# EasyEDA Pro project ProPrj_嵌赛国赛_2025-08-15.epro, board PCB4
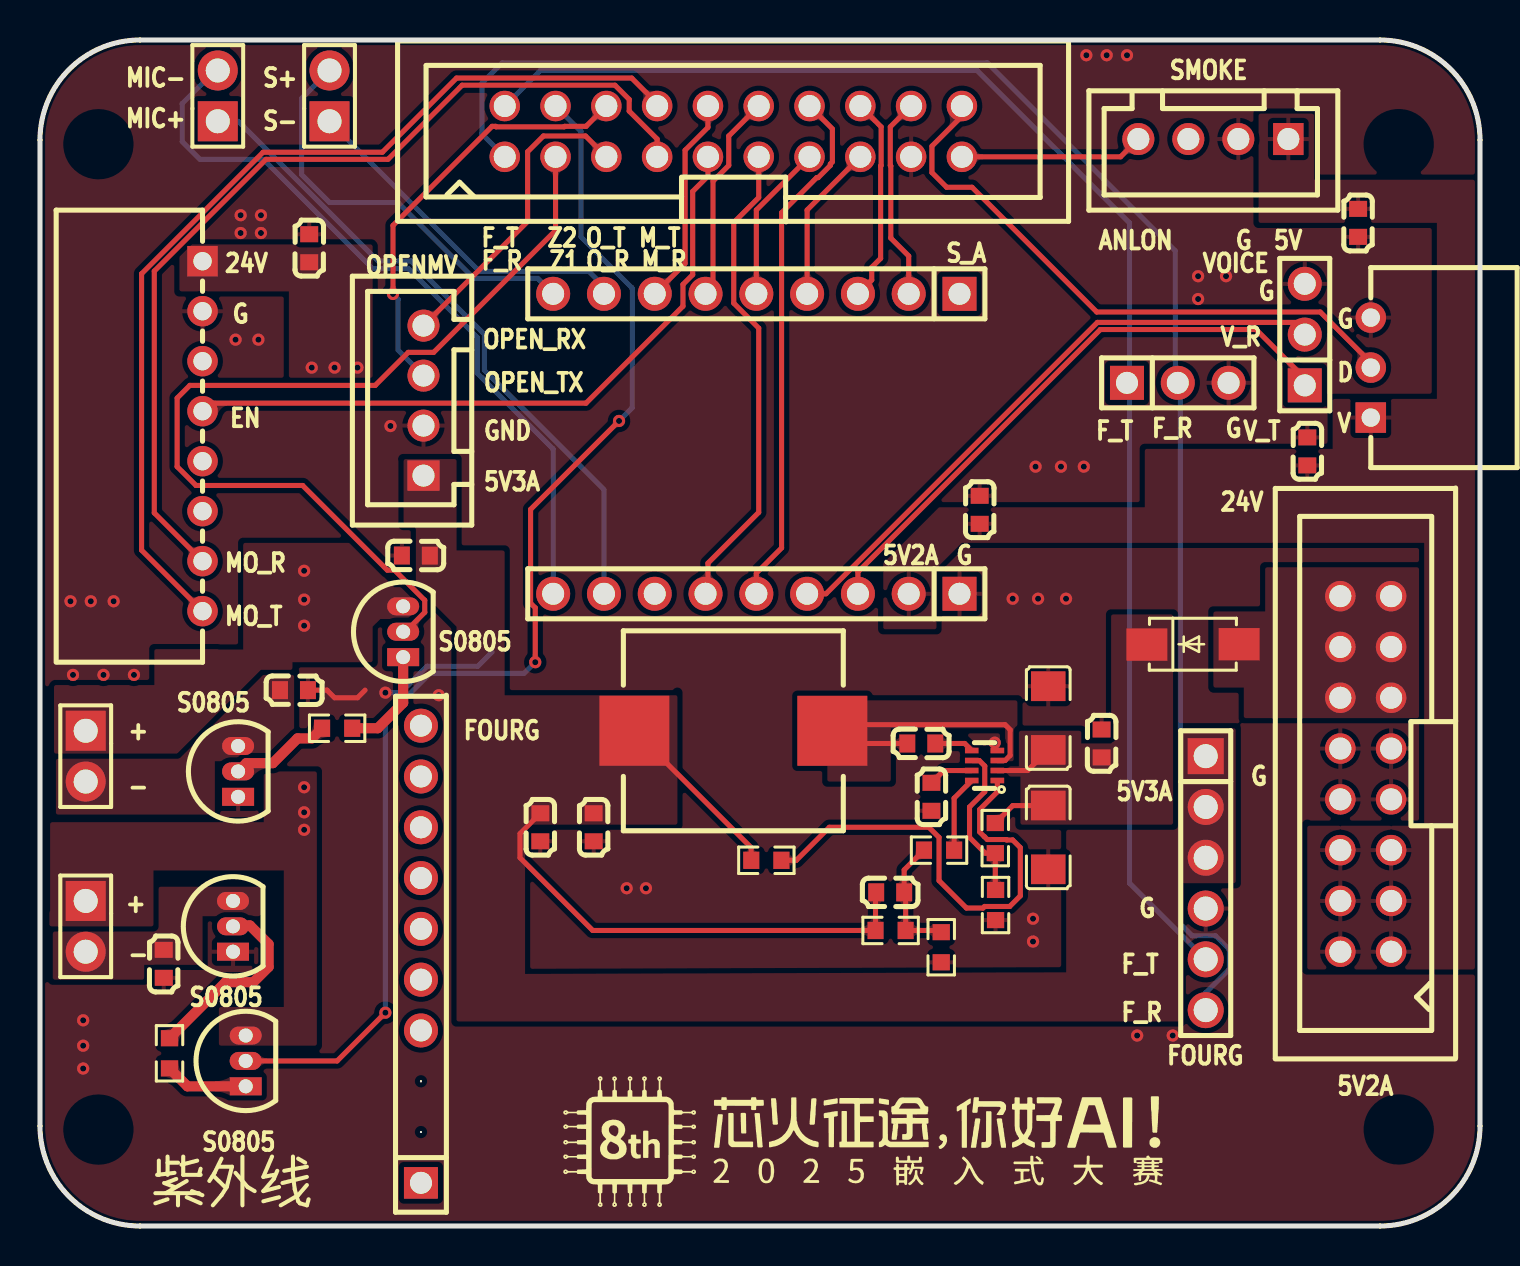
[diagram p18: board, top side]
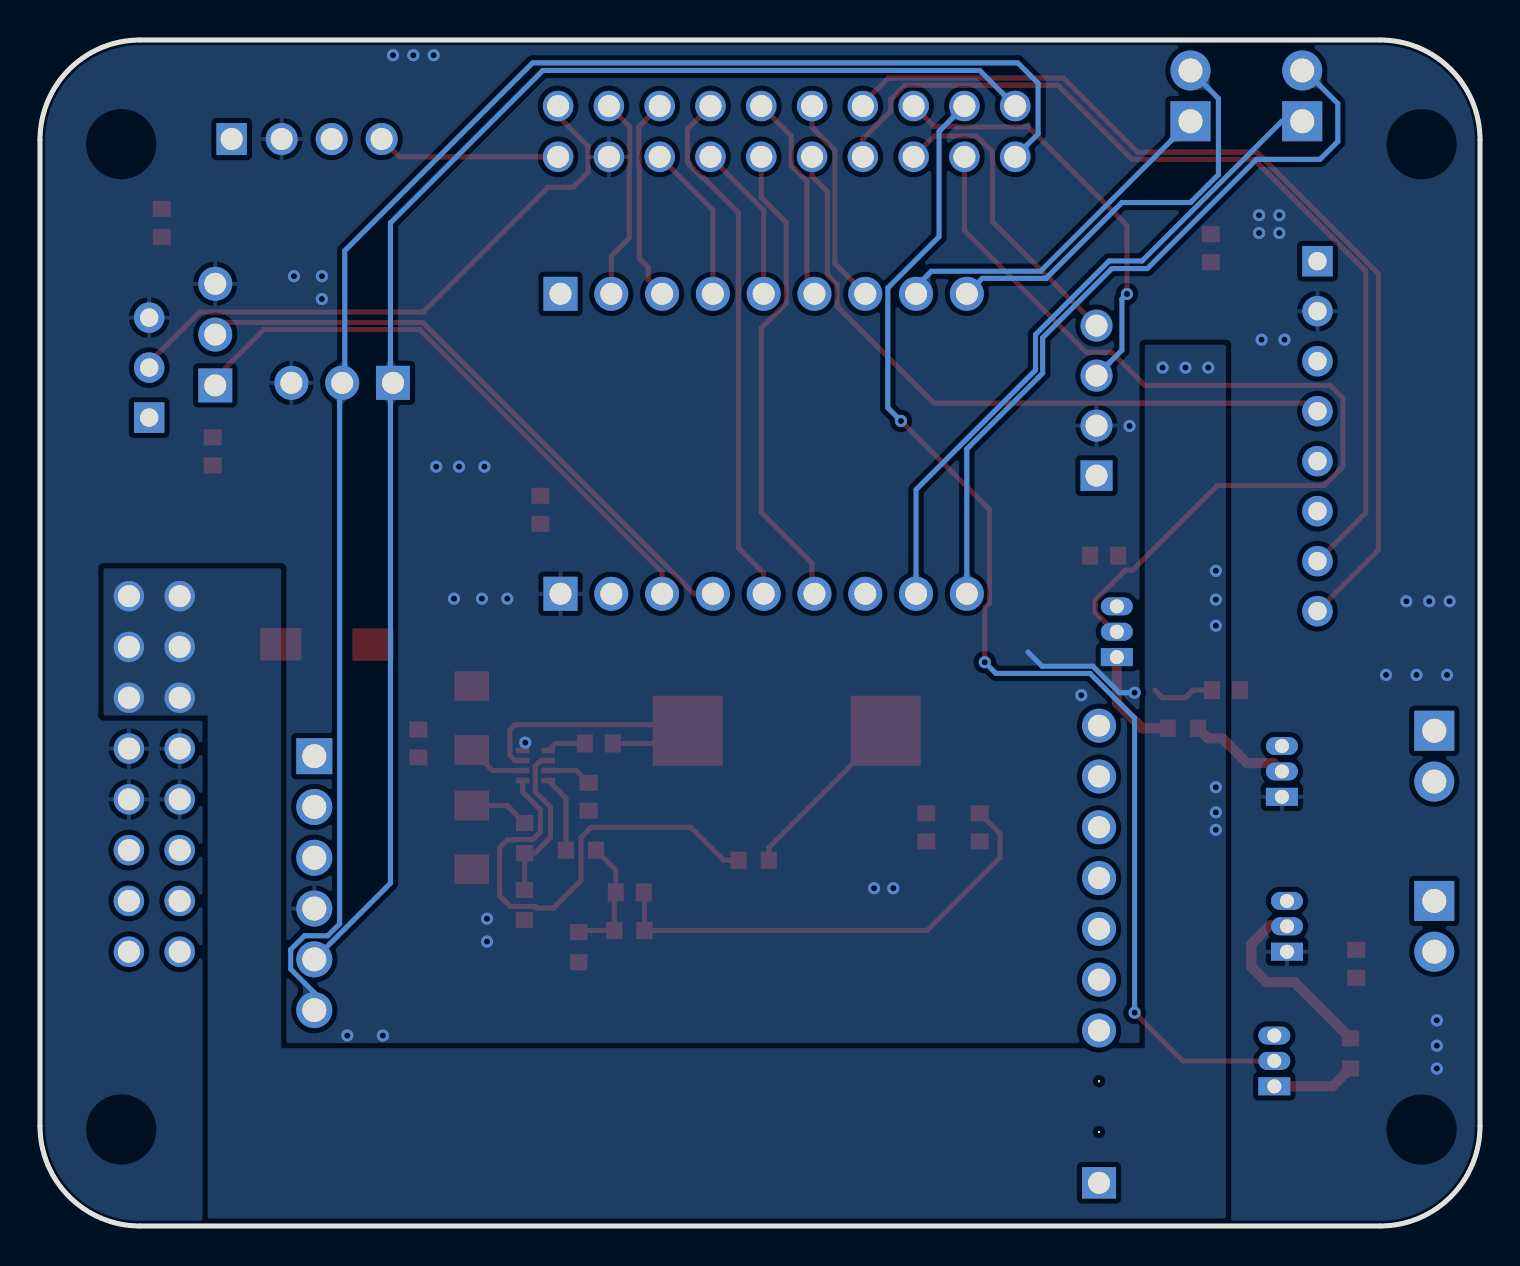
[diagram p19: board, bottom side, seen from below]

Outline 72.01 x 59.31 mm; copper layers: Top Layer, Bottom Layer. Coordinates in mm from the lower left corner of the outline.
Outline path: 0,54.31 0,5 arc(1.46,1.46) 5,0 67.01,0 arc(70.54,1.46) 72.01,5 72.01,54.31 arc(70.54,57.84) 67.01,59.31 5,59.31 arc(1.46,57.84) 0,54.31
Stack: Top Layer 0.035mm / Dielectric1 1.51mm FR4 er 4.5 / Bottom Layer 0.035mm

## Design rules (mm)
template: 自定义配置
spacing copperThickness1oz (default): track to track 0.102, other pairs 0.152 to 0.3
spacing copperThickness2oz: track to track 0.203, other pairs 0.152 to 0.3
track width copperThickness1oz (default): min 0.127, default 0.254, max 2.54
track width copperThickness2oz: min 0.203, default 0.254, max 2.54
differential pair differentialPair (default): width min 0.127, default 0.254, max 2.54; gap min 0.152, default 0.152
via viaSize (default): diameter min 0.5, default 0.61, max 10; hole min 0.3, default 0.305, max 6.3
net 24V_OUT uses 21
net 24_VIN uses 21
net $2N854 uses 21
net VIN uses 21
net $1N464 uses 21
net $1N705 uses 21

## Placement (name value [footprint] x y rotation side)
C77  100nF  [C0603]  53.09 24.13 270 top
C78  10uF  [C1206]  50.42 25.4 270 top
C79  10uF  [C1206]  50.42 19.43 90 top
C80  22nF  [C0603]  44.58 21.46 270 top
C81  100nF  [C0603]  44.07 24.13 0 top
C82  22uF  [C0603]  27.69 19.94 270 top
C83  22uF  [C0603]  25.02 19.94 270 top
C84  300pF  [C0603]  42.51 16.68 180 top
C85  100nF  [C0603]  12.7 26.8 180 top
C86  100nF  [C0603]  6.19 13.11 90 top
C87  100nF  [C0603]  46.99 35.81 270 top
C88  100nF  [C0603]  65.91 50.16 90 top
C90  100nF  [C0603]  13.46 48.89 270 top
C91  100nF  [C0603]  18.8 33.53 0 top
C92  100nF  [C0603]  63.37 38.73 270 top
CN1  ZX-XH2.54-4PZZ  [CONN-TH_4P-P2.50_4PIN]  58.67 54.36 180 top
CN3  BH254V-20P  [CONN-TH_20P-P2.54_0702462001]  34.67 54.74 0 top
CN4  ZX-XH2.54-4PZZ  [CONN-TH_4P-P2.50_4PIN]  19.18 41.27 90 top
D1  SS34  [SMA_L4.3-W2.6-LS5.0-FD]  57.66 29.08 180 top
H1  PZ254V-11-02P  [HDR-TH_2P-P2.54-V-M]  2.29 23.49 270 top
H2  PZ254V-11-02P  [HDR-TH_2P-P2.54-V-M]  2.29 14.99 270 top
H3  PZ254V-11-09P  [HDR-TH_9P-P2.54-V-M]  35.82 46.62 180 top
H4  PZ254V-11-09P  [HDR-TH_9P-P2.54-V-M]  35.82 31.62 180 top
H5  PZ254V-11-02P  [HDR-TH_2P-P2.54-V-M]  14.48 56.52 90 top
H6  PZ254V-11-02P  [HDR-TH_2P-P2.54-V-M]  8.89 56.52 90 top
H7  2.54-1x6P直针  [HDR-TH_6P-P2.54-V-M-1]  58.29 17.14 270 top
H8  PZ254V-11-10P  [HDR-TH_10P-P2.54-V-M]  19.05 13.59 90 top
L1  6.8uH  [IND-SMD_L11.0-W10.0]  34.67 24.77 0 top
P1  2.54-2*8P简牛  [IDC-TH_16P-P2.54_C3406]  66.29 22.61 90 top
Q2  S8050(RANGE:120-200)  [TO-92-3_L4.9-W3.7-P1.27-L]  9.91 22.73 90 top
Q3  S8050(RANGE:120-200)  [TO-92-3_L4.9-W3.7-P1.27-L]  9.65 14.99 90 top
Q4  S8050(RANGE:120-200)  [TO-92-3_L4.9-W3.7-P1.27-L]  18.16 29.72 90 top
Q5  S8050(RANGE:120-200)  [TO-92-3_L4.9-W3.7-P1.27-L]  10.29 8.25 90 top
R1  191kΩ  [R0603]  47.77 19.4 90 top
R2  49.9kΩ  [R0603]  47.78 16.05 90 top
R3  10kΩ  [R0603]  44.96 18.8 180 top
R4  10kΩ  [R0603]  45.07 13.94 90 top
R5  90kΩ  [R0603]  42.53 14.78 180 top
R6  10kΩ  [R0603]  36.32 18.29 0 top
R7  1kΩ  [R0603]  14.86 24.89 180 top
R8  1kΩ  [R0603]  6.48 8.64 90 top
U1  ZX-XH2.54-8PWZ  [CONN-TH_8P-P2.50_ZX-XH2.54-8PWZ]  8.13 39.5 270 top
U2  MP2338GTL-Z  [SOT-583-8_L2.1-W1.2-P0.50-LS1.6-BR]  47.23 23.03 0 top
U3  PH2.54-01-03PZD  [HDR-TH_3P-P2.54-V-M]  63.25 44.58 90 top
U4  PH2.54-01-03PZD  [HDR-TH_3P-P2.54-V-M]  56.9 42.16 0 top
U5  WAFER-XH2.54-3PWZ  [CONN-TH_3P-P2.50_WAFER-XH2.54-3PWZ]  66.55 42.93 90 top

## Footprints (pads in the part's own frame, mm; a bottom-side part is the same pattern mirrored in y, then rotated)
C0603
  rect 0.8x0.9 smd: 1(-0.7,0) 2(0.7,0)
C1206
  rect 1.485x1.728 smd: 1(-1.593,0) 2(1.593,0)
CONN-TH_3P-P2.50_WAFER-XH2.54-3PWZ
  rect 1.524x1.524 hole 0.914: 1(-2.5,0)
  round 1.524 hole 0.914: 2(0,0) 3(2.5,0)
CONN-TH_4P-P2.50_4PIN
  rect 1.524x1.6 hole 1.1: 1(-3.75,0)
  round 1.6 hole 1.1: 2(-1.25,0) 3(1.25,0) 4(3.75,0)
CONN-TH_8P-P2.50_ZX-XH2.54-8PWZ
  rect 1.524x1.524 hole 0.914: 1(-8.75,0)
  round 1.524 hole 0.914: 2(-6.25,0) 3(-3.75,0) 4(-1.25,0) 5(1.25,0) 6(3.75,0) 7(6.25,0) 8(8.75,0)
CONN-TH_20P-P2.54_0702462001
  round 1.524 hole 1.1: 1(-11.43,-1.27) 2(-11.43,1.27) 3(-8.89,-1.27) 4(-8.89,1.27) 5(-6.35,-1.27) 6(-6.35,1.27) 7(-3.81,-1.27) 8(-3.81,1.27) 9(-1.27,-1.27) 10(-1.27,1.27) 11(1.27,-1.27) 12(1.27,1.27) 13(3.81,-1.27) 14(3.81,1.27) 15(6.35,-1.27) 16(6.35,1.27) 17(8.89,-1.27) 18(8.89,1.27) 19(11.43,-1.27) 20(11.43,1.27)
HDR-TH_2P-P2.54-V-M
  rect 2x2 hole 1.2: 1(-1.27,0)
  round 2 hole 1.2: 2(1.27,0)
HDR-TH_3P-P2.54-V-M
  rect 1.7x1.7 hole 1.1: 1(-2.54,0)
  round 1.7 hole 1.1: 2(0,0) 3(2.54,0)
HDR-TH_6P-P2.54-V-M-1
  rect 1.8x1.8 hole 1.2: 1(-6.35,0)
  round 1.8 hole 1.2: 2(-3.81,0) 3(-1.27,0) 4(1.27,0) 5(3.81,0) 6(6.35,0)
HDR-TH_9P-P2.54-V-M
  rect 1.7x1.7 hole 1.1: 1(-10.16,0)
  round 1.7 hole 1.1: 2(-7.62,0) 3(-5.08,0) 4(-2.54,0) 5(0,0) 6(2.54,0) 7(5.08,0) 8(7.62,0) 9(10.16,0)
HDR-TH_10P-P2.54-V-M
  rect 1.575x1.7 hole 1.1: 1(-11.43,0)
  round 0.1 hole 1.1x0.1: 2(-8.89,0) 3(-6.35,0)
  round 1.7 hole 1.1: 4(-3.81,0) 5(-1.27,0) 6(1.27,0) 7(3.81,0) 8(6.35,0) 9(8.89,0) 10(11.43,0)
IDC-TH_16P-P2.54_C3406
  round 1.524 hole 1.1: 1(-8.89,-1.27) 2(-8.89,1.27) 3(-6.35,-1.27) 4(-6.35,1.27) 5(-3.81,-1.27) 6(-3.81,1.27) 7(-1.27,-1.27) 8(-1.27,1.27) 9(1.27,-1.27) 10(1.27,1.27) 11(3.81,-1.27) 12(3.81,1.27) 13(6.35,-1.27) 14(6.35,1.27) 15(8.89,-1.27) 16(8.89,1.27)
IND-SMD_L11.0-W10.0
  rect 3.5x3.5 smd: 1(-4.95,0) 2(4.95,0)
R0603
  rect 0.806x0.864 smd: 1(-0.753,0) 2(0.753,0)
SMA_L4.3-W2.6-LS5.0-FD
  rect 2.046x1.62 smd: 1(-2.304,-0.009) 2(2.304,0.009)
SOT-583-8_L2.1-W1.2-P0.50-LS1.6-BR
  rect 0.68x0.28 smd: 1(0.64,-0.75) 2(0.64,-0.25) 3(0.64,0.25) 4(0.64,0.75) 5(-0.64,0.75) 6(-0.64,0.25) 7(-0.64,-0.25) 8(-0.64,-0.75)
TO-92-3_L4.9-W3.7-P1.27-L
  rect 0.9x1.6 hole 0.7: 1(-1.27,0)
  oval 0.9x1.6 hole 0.7: 2(0,0) 3(1.27,0)

## Nets
As in the schematic.

Pads without a net: H8 1 2 3 4 9 10; U1 3 5 6

## Via types
v1: diameter 0.61, hole 0.305, Top Layer to Bottom Layer, 50 vias

## Routing (per net, layer and track width the routed paths; a pad name or vN(x,y) marks a point on that pad's centre or on a via; arc(x,y) is an arc through that point)
24V_OUT:
  vias: v1(13.21,32.77) v1(13.21,31.33) v1(13.21,30.02) v1(13.21,21.94) v1(13.21,20.69) v1(13.21,19.81) v1(13.59,42.93) v1(14.73,42.93) v1(15.88,42.93)
GND: length 9.3
  Top Layer w0.254: C85.1 14.35,26.8 14.73,26.42 15.88,26.42 16.26,26.8
  Bottom Layer w0.254: v1(17.27,26.67) 18.03,26.67 19.35,27.99 21.9,27.99 22.61,28.7
  vias: v1(1.52,31.24) v1(1.65,27.56) v1(2.16,10.29) v1(2.16,9.02) v1(2.16,7.87) v1(2.54,31.24) v1(3.17,27.56) v1(3.68,31.24) v1(4.7,27.56) v1(9.78,44.32) v1(10.03,50.55) v1(10.03,49.66) v1(10.92,44.32) v1(11.05,50.55) v1(11.05,49.66) v1(17.53,40) v1(19.94,26.54) v1(29.34,16.89) v1(30.3,16.89) v1(47.74,24.17) v1(48.64,31.37) v1(49.66,15.37) v1(49.66,14.22) v1(49.78,37.97) v1(49.91,31.37) v1(51.05,37.97) v1(51.31,31.37) v1(52.2,37.97) v1(52.32,58.55) v1(53.34,58.55) v1(54.36,58.55) v1(54.86,9.52) v1(56.64,9.52) v1(57.91,47.5) v1(57.91,46.35) v1(59.31,47.5)
VIN: length 32.7
  Top Layer w0.254: C83.1 24,19.62 24,18.41 27.64,14.78 R5.2 41.78,16.65 C84.2 ; L1.1 35.56,18.93 35.56,18.3 R6.1
24_VIN: length 6
  Top Layer w0.254: C78.2 49.39,22.78 U2.2 ; R1.2 48.64,21.02 C79.2
DIANYUAN_EN: length 8.1
  Top Layer w0.254: U2.6 46.97,23.28 47.24,23 47.24,21.72 46.48,20.95 46.48,19.43 47.27,18.64 47.77,18.64 47.77,16.82 R2.2
FB: length 3.8
  Top Layer w0.254: R3.1 45.71,21.39 U2.8
FOUR1_RX: length 83
  Bottom Layer w0.254: 57.02,41.78 57.02,15.11 57.62,14.51 58.78,14.51 59.47,13.82 59.47,12.85 58.29,11.67 H7.6 ; U4.2 56.77,42.29 56.77,48.77 47.37,58.17 23.11,58.17 22.1,57.15 22.1,54.61 CN3.1
FOUR1_TX: length 73.5
  Bottom Layer w0.254: CN3.2 25.02,57.78 46.86,57.78 54.48,50.16 54.48,17.14 H7.5
HOST_PA4: length 10.5
  Top Layer w0.254: H3.6 33.66,46.99 33.66,52.25 34.44,53.04 34.44,54.51 CN3.12
HOST_PA5: length 24
  Top Layer w0.254: CN3.11 35.94,51.43 34.69,50.18 34.69,46.15 35.94,44.9 35.94,35.69 33.4,33.15 33.4,31.74 H4.6
HOST_PA6: length 10.5
  Top Layer w0.254: H3.7 32.26,48.13 32.26,53.8 33.4,54.94 CN3.10
HOST_PC0: length 10.3
  Top Layer w0.254: H3.3 41.59,47.31 41.59,47.94 42.04,48.39 42.04,53.01 42.06,53.04 42.06,54.97 CN3.16
HOST_PC2: length 10.2
  Top Layer w0.254: H3.2 43.44,48.51 42.54,49.4 42.54,53.01 42.52,53.04 42.52,54.97 CN3.18
HOST_PC3: length 26.5
  Top Layer w0.254: CN3.14 39.62,54.86 39.62,53.21 39.52,53.11 39.52,53.04 38.91,52.43 38.84,52.43 37.08,50.67 37.08,33.91 35.82,32.65 H4.5
HOST_U4_RX: length 8
  Top Layer w0.254: H3.5 35.82,50.81 CN3.13
HOST_U4_TX: length 8
  Top Layer w0.254: H3.4 38.36,50.81 CN3.15
MIC+: length 33.2
  Bottom Layer w0.254: H6.1 9.91,55.24 16.9,48.26 18.54,48.26 22.22,44.58 22.22,42.8 28.2,36.82 H4.8
MIC-: length 37.6
  Bottom Layer w0.254: H6.2 8.76,57.78 7.11,56.13 7.11,54.23 8,53.34 11.18,53.34 16.64,47.88 18.41,47.88 21.87,44.42 21.87,42.65 22.1,42.42 22.1,42.42 25.66,38.85 H4.9
MOTOR_EN: length 34.2
  Top Layer w0.254: U1.4 8.53,41.15 27.31,41.15 32.15,45.99 32.15,47.08 32.64,47.57 32.64,51.74 33.4,52.5 CN3.9
MOTOR_RX: length 46.8
  Top Layer w0.254: CN3.7 30.86,54.36 29.46,55.75 29.46,56.34 28.75,57.05 21.11,57.05 17.4,53.34 11.3,53.34 5.72,47.75 5.72,35.66 U1.7
MOTOR_TX: length 48.6
  Top Layer w0.254: U1.8 5.08,33.8 5.08,47.62 11.16,53.7 17.12,53.7 20.83,57.4 29.59,57.4 30.86,56.13 CN3.8
OPENMV_RX: length 15.5
  Top Layer w0.254: CN3.5 27.28,54.51 25.17,54.51 24.38,53.72 24.38,50.23 CN4.4
OPENMV_TX: length 21.3
  Top Layer w0.254: v1(17.65,46.61) 17.65,50.04 22.61,54.99 22.78,54.99 22.81,54.97 26.21,54.97 26.24,54.99 27.31,54.99 CN3.6
  Bottom Layer w0.254: v1(17.65,46.61) 17.91,46.35 17.91,43.8 CN4.3
SMOKE_A: length 9.2
  Top Layer w0.254: CN3.19 54.03,53.47 CN1.4
SPK+: length 20.8
  Bottom Layer w0.254: H3.9 24.89,47.39 21.7,47.39 17.91,51.18 14.48,51.18 13.08,52.58 13.08,56.39 H5.2
SPK-: length 17.5
  Bottom Layer w0.254: H5.1 21.98,47.74 27.44,47.74 28.2,46.98 H3.8
TEMP: length 30.1
  Top Layer w0.254: U5.2 66.55,43.18 64.02,45.71 52.85,45.71 46.61,51.94 45.34,51.94 44.6,52.68 44.6,54 46.1,55.5 CN3.20
ULTRAVIOLET_RAY_COUNTER: length 46.7
  Top Layer w0.254: Q4.2 18.41,29.97 18.53,29.97 19.24,30.69 19.24,31.29 17.73,32.8 17.37,32.8 13.13,37.03 7.8,37.03 6.86,37.97 6.86,41.4 7.49,42.04 16.76,42.04 18.41,43.69 19.69,43.69 25.78,49.78 CN3.3
ULTRAVIOLET_RAY_COUNTER_2: length 63
  Top Layer w0.254: v1(24.76,28.19) 24.76,30.92 24.53,31.15 24.53,35.83 v1(28.96,40.26) ; v1(17.27,10.67) 14.86,8.25 Q5.2
  Bottom Layer w0.254: CN3.4 27.05,54.74 27.05,49.47 29.61,46.91 29.61,40.91 v1(28.96,40.26) ; v1(24.76,28.19) 24.21,27.63 19.51,27.63 17.27,25.4 v1(17.27,10.67)
VOICE_MODULE_RX: length 31.6
  Top Layer w0.254: H4.4 39.3,31.62 52.88,45.19 63.5,45.19 63.5,44.58 U3.2
VOICE_MODULE_TX: length 29.8
  Top Layer w0.254: H4.3 40.9,32.71 53.02,44.83 60.81,44.83 63.25,42.4 U3.1
$1N7267: length 5.4
  Top Layer w0.508: Q4.1 18.16,26.16 16.89,24.89 R7.1
$1N7311: length 5.1
  Top Layer w0.508: Q2.2 10.32,23.15 11.64,23.15 12.88,24.38 13.6,24.38 R7.2
$1N7416: length 4.2
  Top Layer w0.508: R8.1 7.37,6.98 Q5.1
$1N7421: length 9.8
  Top Layer w0.508: Q3.2 9.69,15.03 10.5,15.03 11.43,14.1 11.43,12.95 10.67,12.19 9.28,12.19 R8.2
$2N835: length 2.3
  Top Layer w0.254: C80.1 45.19,22.78 U2.7
$2N852: length 2
  Top Layer w0.254: U2.5 46.24,24.13 C81.2
$2N854: length 15.5
  Top Layer w0.254: 39.81,24.57 40.31,25.07 48.26,25.07 48.51,24.82 48.51,23.53 48.26,23.28 U2.3 ; 39.81,24.57 39.5,24.26 ; 39.81,24.57 40.26,24.13 C81.1 ; 39.81,24.57 L1.2
$2N884: length 6.3
  Top Layer w0.254: R3.2 43.21,17.81 C84.1 43.29,16.61 R5.1 44.98,14.78 R4.2
$2N892: length 23.5
  Top Layer w0.254: U2.1 47.87,21.71 46.99,20.83 46.99,19.7 47.22,19.47 47.23,19.47 47.37,19.33 48.32,19.33 48.34,19.3 48.64,19.3 49.02,18.92 49.02,16.51 48.49,15.98 47.24,15.98 47.16,15.9 46.33,15.9 44.96,17.27 44.96,19.43 44.45,19.94 39.47,19.94 37.82,18.29 R6.2

## Copper pours and planes (outline as drawn; the poured copper is in the pictures)
5V2A_OUT on Top Layer: 55.25,38.86 55.25,35.94 44.96,35.94 42.16,33.15 42.16,29.84 44.83,29.84 44.83,32.89 46.1,34.16 69.22,34.16 69.22,20.02 63.42,20.02 63.37,20.07 63.37,12.83 71.75,12.83 71.75,52.32 63.71,52.32 63.71,55.63 60.94,55.63 60.94,50.16 69.85,50.16 69.85,41.36 64.64,41.36 64.64,38.86
24V_OUT on Top Layer: 58.67,30.73 61.26,30.73 61.26,32.94 68.96,32.94 68.96,25.4 60.2,25.4 60.2,26.92 58.69,26.92 58.67,26.94
24V_OUT on Top Layer: 8.93,28.83 10.16,28.83 10.16,34.16 15.49,34.16 17.71,31.95 18.16,31.95 19.24,30.87 19.24,30.69 18.91,30.35 17.02,30.35 16.64,29.97 16.64,28.19 12.62,28.19 12.62,27.81 11.05,27.81 6.86,23.62 0.7,23.62 0.7,26.99 0.76,27.05 5.72,27.05 5.72,28.84 8.91,28.84
24V_OUT on Top Layer: 5.67,17.78 5.67,14.98 0.48,14.98 0.47,14.99 0.47,15.71 0.51,15.75 0.51,20.19 11.19,20.19 11.19,22.73 13.84,22.73 13.84,9.02 8.94,9.02 8.94,10.95 12.19,10.95 12.19,17.78
24V_OUT on Top Layer: 16.64,42.42 12.45,42.42 12.45,46.74 6.97,46.74 6.97,49.01 7.05,49.09 16.57,49.09 16.64,49.02
24V_OUT on Bottom Layer: 59.94,32.89 68.83,32.89 68.83,25.53 63.63,25.53 63.63,0.38 12.7,0.38 12.7,44.07 16.76,44.07 16.76,8.89 59.94,8.89
GND on Top Layer: -11.43,64.13 98.55,64.13 105.54,57.15 105.54,22.35 78.99,-4.19 -2.92,-4.19 -11.43,4.32
GND on Bottom Layer: -22.73,70.87 146.43,70.87 158.62,58.67 94.62,-5.33 94.62,-13.72 -2.16,-13.72 -22.73,6.86
VIN on Top Layer: 20.83,10.23 20.83,29.97 18.8,32 18.8,34.86 18.61,35.05 18.18,35.05 18.18,38.33 18.16,38.35 20.83,38.35 20.83,33.78 23.24,33.78 23.24,26.55 23.24,26.54 31.75,26.54 31.88,26.67 31.88,20.07 24.26,20.07 24.26,12.61 51.32,12.69 51.32,19.94 56.77,19.94 56.77,24.89 59.8,24.89 59.8,17.14 57.04,17.14 57.04,10.23 57.04,10.23
24_VIN on Top Layer: 56.66,20.07 49.02,20.07 49.02,22.48 47.5,22.48 47.5,22.99 48.95,22.99 48.95,24.77 52.07,24.77 52.07,24.13 53.56,24.13 53.56,30.58 56.66,30.58
$1N464 on Top Layer: 6.86,23.49 0.8,23.49 0.8,20.57 8.75,20.57 8.75,23.24 12.06,23.24 12.71,24.56 12.71,27.71 10.99,27.63
$1N705 on Top Layer: 0.64,14.99 0.64,12.32 5.21,12.32 5.21,13.06 8.1,13.06 8.13,13.08 8.13,15.49 11.03,15.49 11.03,16.87 11.12,16.97 5.76,16.97 5.76,14.99
$2N854 on Top Layer: 47.5,23.49 47.5,22.99 48.88,22.99 48.88,26.29 39.37,26.29 39.37,22.22 42.54,22.22 42.54,24.89 48.26,24.89 48.26,23.49

Small or netless copper shapes (teardrops, artwork), in the pictures only: 69 on Top Layer, 19 on Bottom Layer

## Text on the board
Top Silkscreen Layer: MIC- | MIC+ | + | - | S0805 | MO_R | MO_T | EN | S+ | S- | OPENMV | FOURG | F_T | F_R | OPEN_RX | OPEN_TX | GND | 5V3A | Z2 | Z1 | O_T | O_R | M_T | M_R | 5V2A | S_A | G | ANLON | SMOKE | VOICE | V_R | 24V | V_T | 5V | D | V | 紫外线
